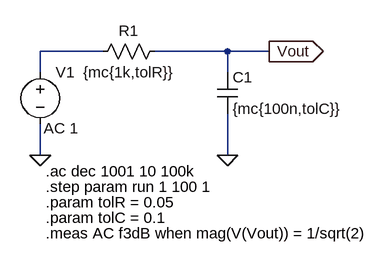
[diagram p0: schematic FilterMC.asc]
FilterMC.asc, the LTspice schematic file:
Version 4
SHEET 1 1220 680
WIRE 80 -160 -16 -160
WIRE 272 -160 160 -160
WIRE 336 -160 272 -160
WIRE -16 -128 -16 -160
WIRE 272 -128 272 -160
WIRE -16 0 -16 -48
WIRE 272 0 272 -64
FLAG -16 0 0
FLAG 272 0 0
FLAG 336 -160 Vout
IOPIN 336 -160 Out
SYMBOL res 176 -176 R90
WINDOW 0 0 56 VBottom 2
WINDOW 3 32 56 VTop 2
SYMATTR InstName R1
SYMATTR Value {mc{1k,tolR}}
SYMBOL voltage -16 -144 R0
WINDOW 3 28 81 Left 2
WINDOW 123 5 102 Left 2
WINDOW 39 0 0 Left 2
SYMATTR Value ""
SYMATTR Value2 AC 1
SYMATTR InstName V1
SYMBOL cap 256 -128 R0
SYMATTR InstName C1
SYMATTR Value {mc{100n,tolC}}
TEXT -8 48 Left 2 !.step param run 1 100 1
TEXT -8 72 Left 2 !.param tolR = 0.05
TEXT -8 96 Left 2 !.param tolC = 0.1
TEXT -8 24 Left 2 !.ac dec 1001 10 100k
TEXT -8 120 Left 2 !.meas AC f3dB when mag(V(Vout)) = 1/sqrt(2)

The netlist it stands for:
* FilterMC.asc
R1 Vout N001 {mc{1k,tolR}}
V1 N001 0 AC 1
C1 Vout 0 {mc{100n,tolC}}
.step param run 1 100 1
.param tolR = 0.05
.param tolC = 0.1
.ac dec 1001 10 100k
.meas AC f3dB when mag(V(Vout)) = 1/sqrt(2)
.backanno
.end